# Altium schematic sheet ZHSD.SchDoc
size A4; SheetNumber: 1; SheetTotal: 10; Size: A3
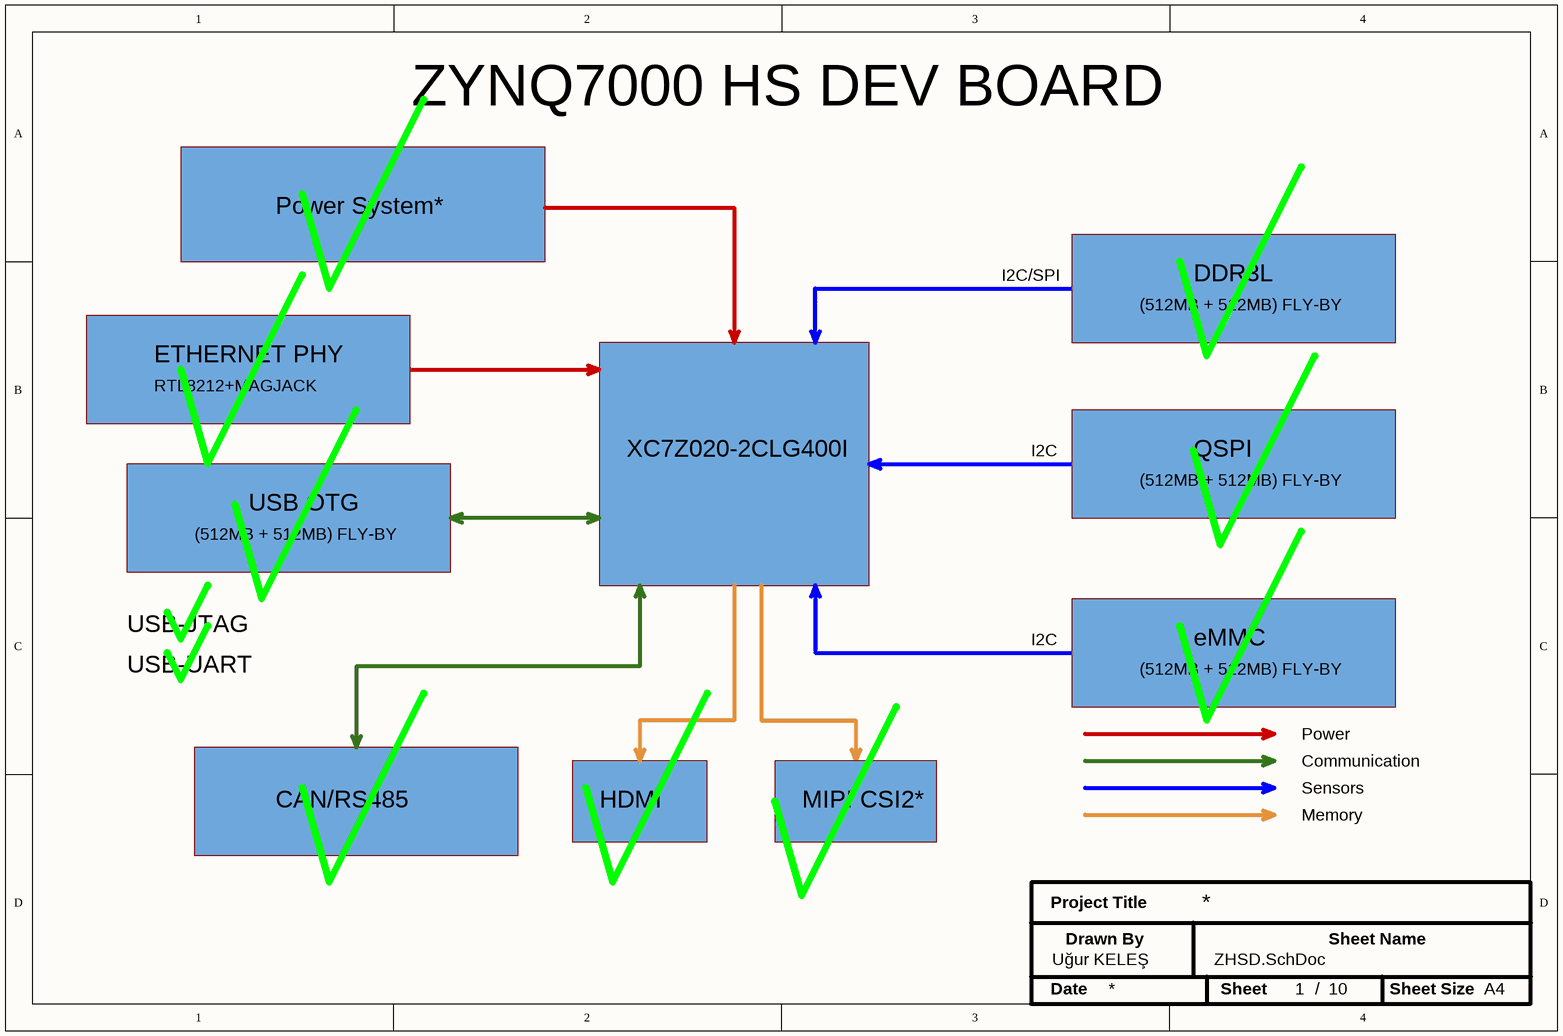
[diagram p0: ZHSD.SchDoc]

## Notes on the sheet
- ZYNQ7000 HS DEV BOARD
- Power System*
- I2C/SPI
- (512MB + 512MB) FLY-BY
- DDR3L
- ETHERNET PHY
- RTL8212+MAGJACK
- I2C
- USB OTG
- XC7Z020-2CLG400I
- QSPI
- USB-JTAG
- eMMC
- USB-UART
- Power
- Communication
- Sensors
- CAN/RS485
- HDMI
- MIPI CSI2*
- Memory
- Project Title
- Uğur KELEŞ
- Drawn By
- Sheet Name
- Date
- Sheet
- /
- Sheet Size
- A4